# Altium schematic sheet PF9_MIDI.SchDoc
size 152 x 152 mm
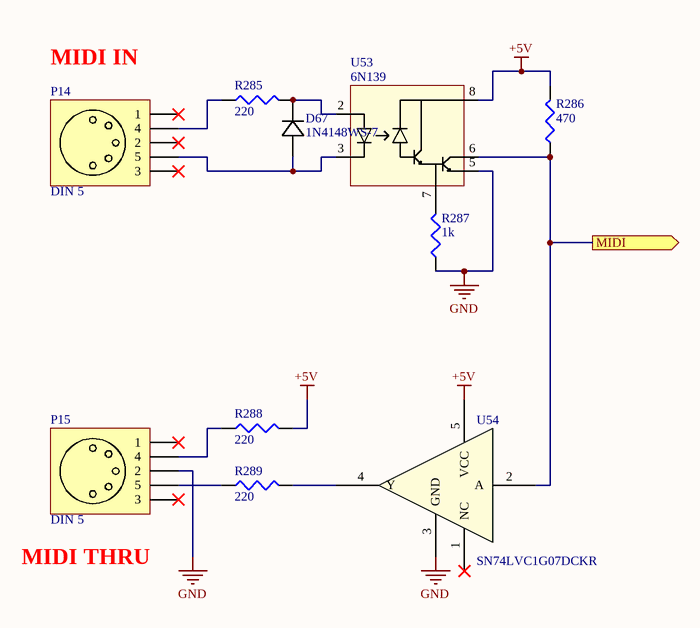
[diagram p0: PF9_MIDI.SchDoc]

## Parts
D67  1N4148WS-7  [SOD323-M]
P14  DIN 5  [PRO SIGNAL_PSG03463]
P15  DIN 5  [PRO SIGNAL_PSG03463]
R285  220  [RESC1608X05]
R286  470  [RESC1608X05]
R287  1k  [RESC1608X05]
R288  220  [RESC1608X05]
R289  220  [RESC1608X05]
U53  6N139  [DIP8_VISHAY_6N13]
U54  SN74LVC1G07DCKR  [DCK5]

## Ports
MIDI (out)

## Nets
+5V: R286.2 R288.2 U53.8(B1) U54.5(VCC)
GND: P15.2 R287.1 U53.5(B1) U54.3(GND)
MIDI: R286.1 U53.6(B1) U54.2(A) ; port MIDI
NetD67_1: D67.1 R285.2 U53.2(B2)
NetD67_2: D67.2 P14.5 U53.3(B1)
NetP14_4: P14.4 R285.1
NetP15_4: P15.4 R288.1
NetP15_5: P15.5 R289.1
NetR287_2: R287.2 U53.7(B1)
NetR289_2: R289.2 U54.4(Y)

Not connected (* = marked no-connect by the designer): P14 1* 2* 3*; P15 1* 3*; U54 1(NC)*

## Notes on the sheet
- (near P14) MIDI IN
- (near P15) MIDI THRU

## Library data of the parts
D67 = 1N4148WS-7: Diode signaux faibles; Fabricant: ON SEMICONDUCTOR; Fournisseur: Farnell; RefFournisseur: 2453269; DataSheet: http://www.farnell.com/datasheets/2288055.pdf; RefFabricant: 1N4148WS
P14 P15 = DIN 5pin: Fabricant: PRO SIGNAL; Fournisseur: Farnell; RefFabricant: PSG03463; RefFournisseur: 1791756; DataSheet: http://www.farnell.com/datasheets/1697491.pdf
R285 R288 R289 = Res3: Resistor; Value: 220k; Fabricant: TE CONNECTIVITY; Fournisseur: Farnell; RefFabricant: CPF-A-0603B220KE1; RefFournisseur: 2483903; Case: 0603 [1608 Metric]; DataSheet: http://www.farnell.com/datasheets/1935020.pdf
R286 = Res3: Resistor; Value: 470k; Fabricant: TE CONNECTIVITY; Fournisseur: Farnell; RefFabricant: CPF0603B470KE1; RefFournisseur: 2331232; Case: 0603 [1608 Metric]; DataSheet: http://www.farnell.com/datasheets/2043335.pdf
R287 = Res3: Resistor; Fabricant: TE CONNECTIVITY; Fournisseur: Farnell; RefFabricant: CPF-A-0603B1K0E1; RefFournisseur: 2483880; Value: 1k; Case: 0603 [1608 Metric]; DataSheet: http://www.farnell.com/datasheets/1935020.pdf
U53 = 6N139: Optocoupler; Fabricant: BOADCOM; Fournisseur: Farnell; RefFabricant: 6N139-300E; RefFournisseur: 1085023; DataSheet: http://www.farnell.com/datasheets/1266261.pdf
U54 = SN74LVC1G07DCKR: Buffers & Transmetteurs; RefFournisseur: 1287544; Fabricant: Texas Instrument; Fournisseur: Farnell; RefFabricant: SN74LVC1G07DCKR; DataSheet: http://www.ti.com/lit/ds/symlink/sn74lvc1g07.pdf